# Altium schematic sheet ProgTool.SchDoc: Carte Découpe DMX
size A4
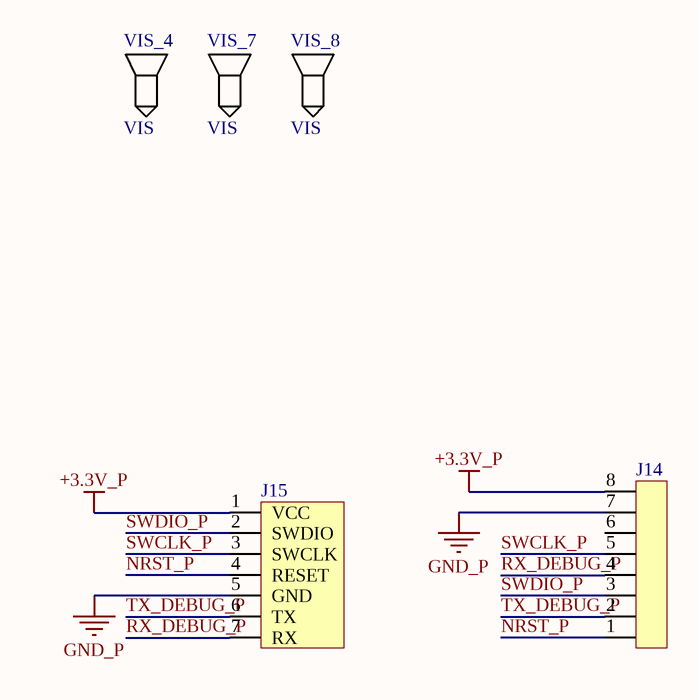
[diagram p0: ProgTool.SchDoc]

## Parts
J14  (no value)  [BARF-2X4]
J15  (no value)  [CON_PROG]
VIS_4  VIS  [HOLE3.5mm]
VIS_7  VIS  [HOLE3.5mm]
VIS_8  VIS  [HOLE3.5mm]

## Nets
+3.3V_P: J14.8 J15.1(VCC)
GND_P: J14.7 J15.5(GND)
NRST_P: J14.1 J15.4(RESET)
RX_DEBUG_P: J14.4 J15.7(RX)
SWCLK_P: J14.5 J15.3(SWCLK)
SWDIO_P: J14.3 J15.2(SWDIO)
TX_DEBUG_P: J14.2 J15.6(TX)

Not connected (* = marked no-connect by the designer): J14 6

## Notes on the sheet
- Title
- Size:
- Date:
- A4
- Number:
- Time:
- Revision:
- Sheet
- of
- File:

## Library data of the parts
J14 = CON-8: Connector 8 points
J15 = CON-PROG: Programming Connector